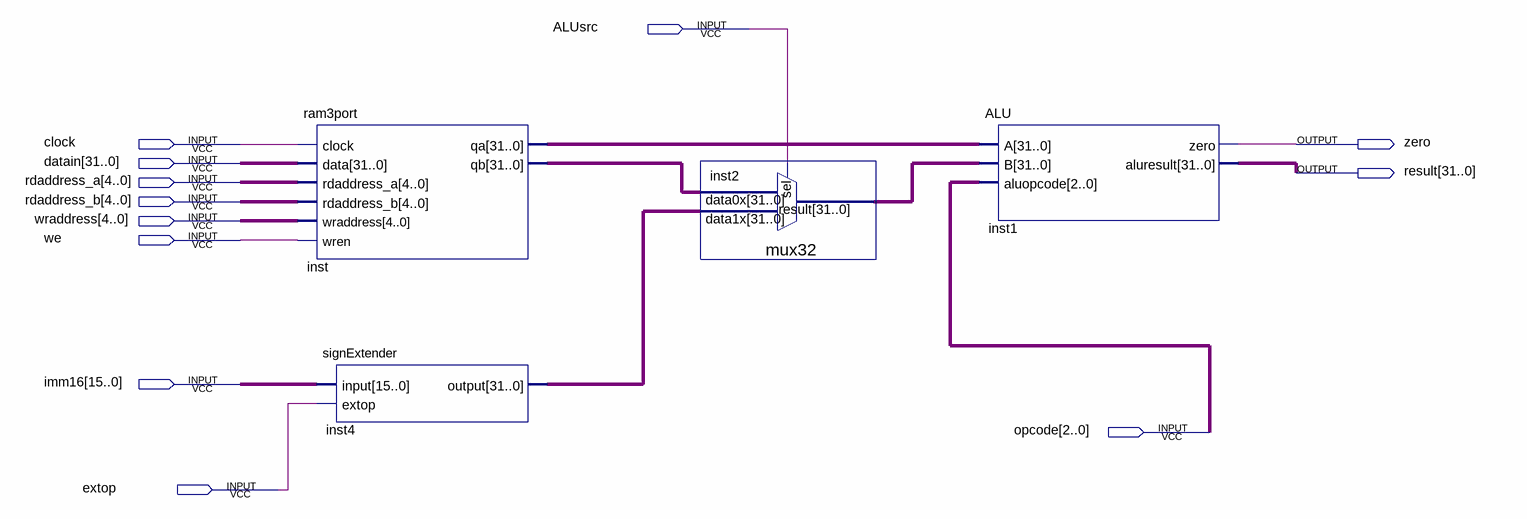
[diagram p0: schematic sheet]
// Quartus schematic logicunit.bdf as structural Verilog: 4 symbols, 12 pins
module logicunit (
  input  ALUsrc,
  input  clock,
  input  [31:0] datain,
  input  [4:0] rdaddress_a,
  input  [4:0] rdaddress_b,
  input  [4:0] wraddress,
  input  we,
  input  [15:0] imm16,
  input  [2:0] opcode,
  input  extop,
  output zero,
  output [31:0] result
);

  wire [31:0] inst2_result, inst4_output, inst_qa, inst_qb;

  ram3port inst (
    .clock(clock), .data(datain), .rdaddress_a(rdaddress_a), .rdaddress_b(rdaddress_b),
    .wraddress(wraddress), .wren(we), .qa(inst_qa), .qb(inst_qb));
  signExtender inst4 (.\input (imm16), .extop(extop), .\output (inst4_output));
  mux32 inst2 (.data1x(inst4_output), .data0x(inst_qb), .sel(ALUsrc), .result(inst2_result));
  ALU inst1 (.A(inst_qa), .B(inst2_result), .aluopcode(opcode), .zero(zero), .aluresult(result));
endmodule
